# Altium schematic sheet 智能车驱动板HIP4082.SchDoc
size B; SheetNumber: 1; SheetTotal: 1
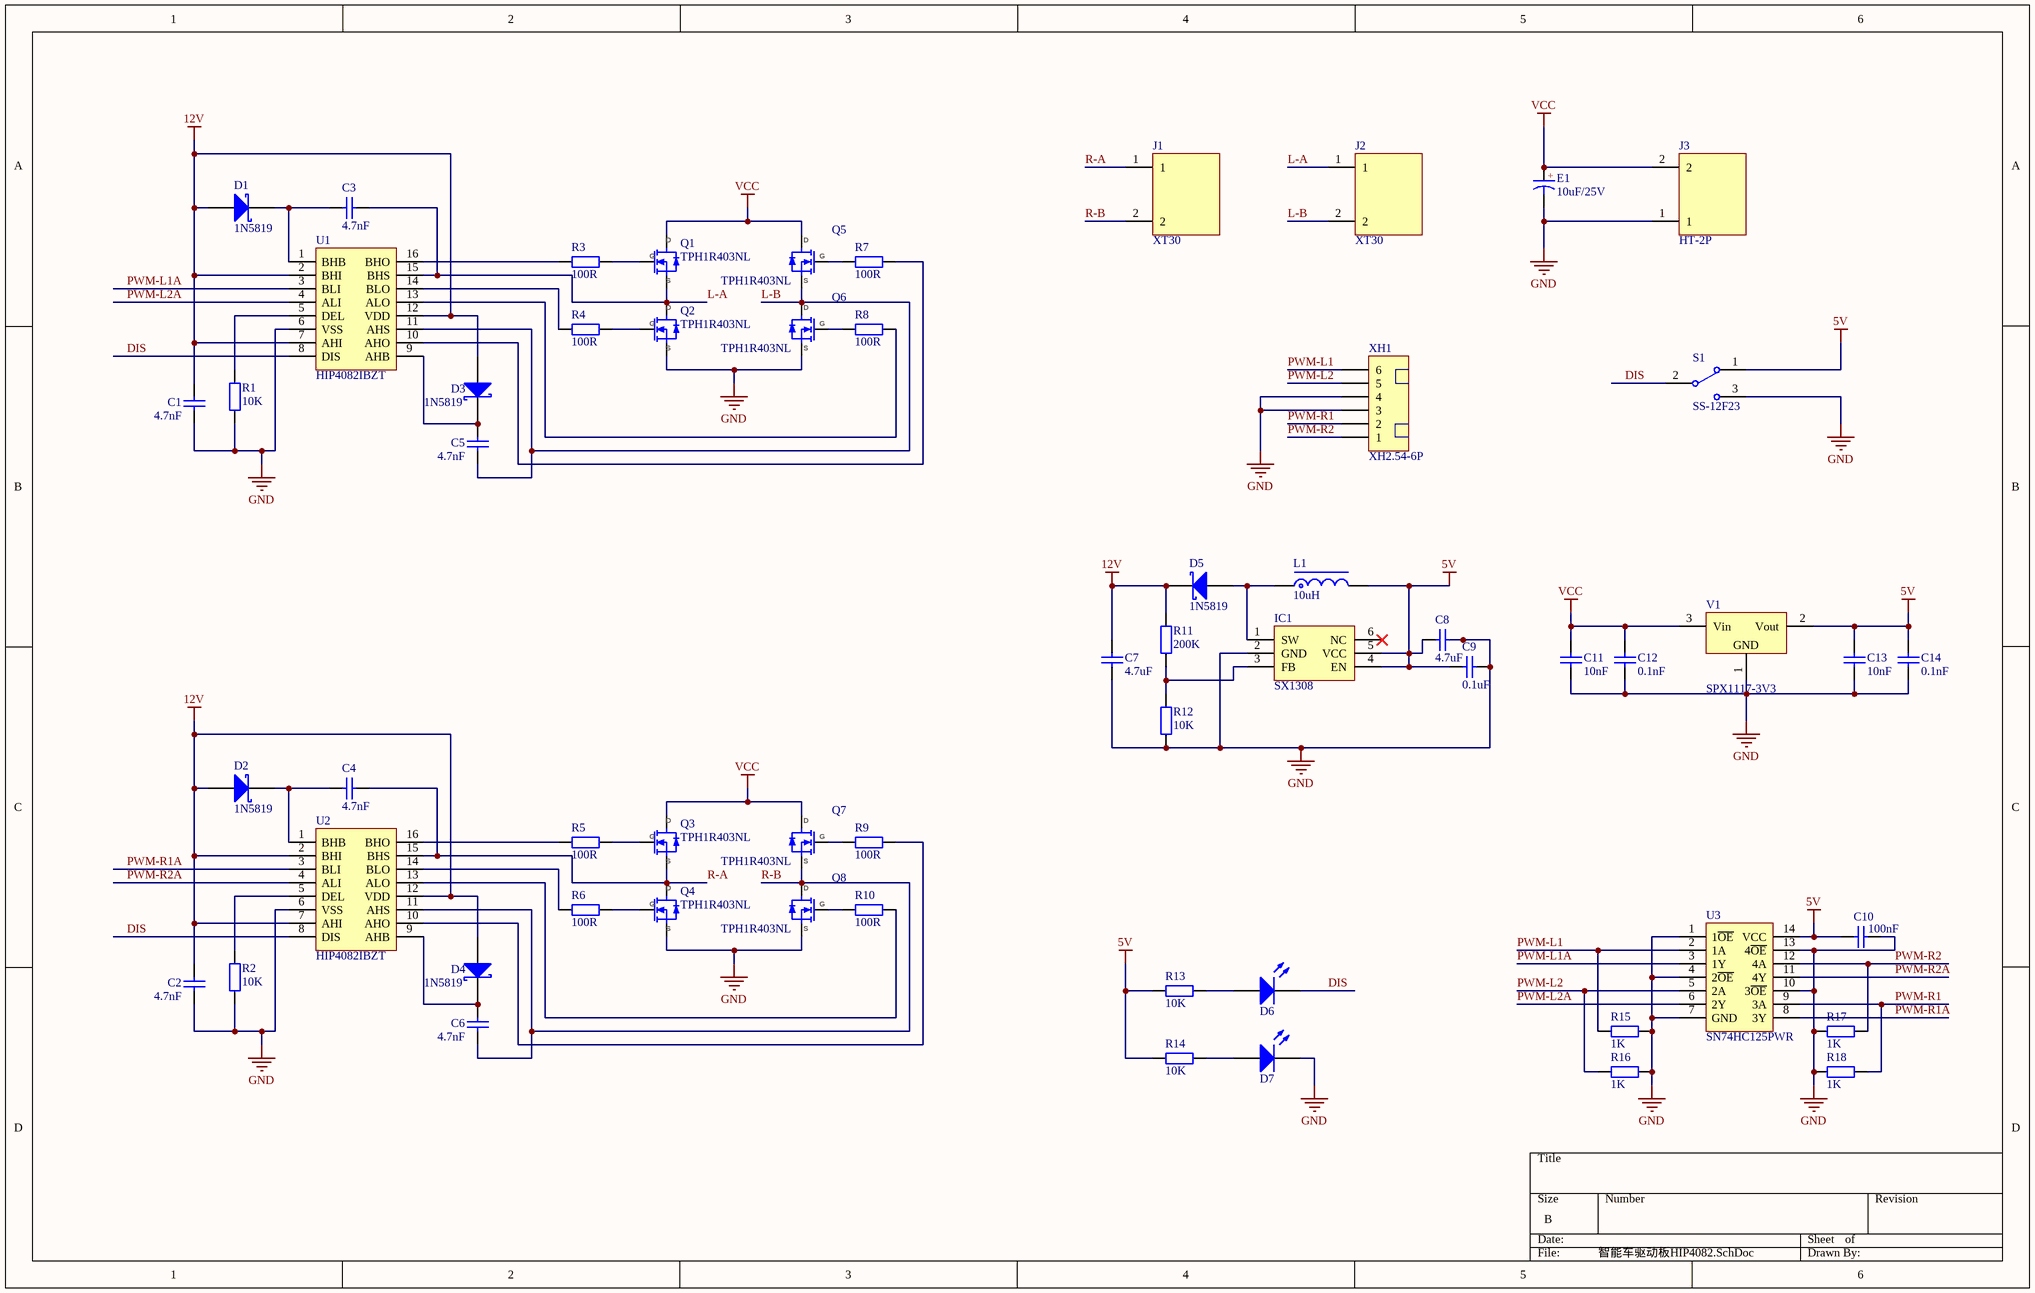
[diagram p0: 智能车驱动板HIP4082.SchDoc]

## Parts
C1  4.7nF  [C0603_L]
C2  4.7nF  [C0603_L]
C3  4.7nF  [C0603_L]
C4  4.7nF  [C0603_L]
C5  4.7nF  [C0603_L]
C6  4.7nF  [C0603_L]
C7  4.7uF  [C0603_L]
C8  4.7uF  [C0603_L]
C9  0.1uF  [C0603_L]
C10  100nF  [C0603_L]
C11  10nF  [C0603_L]
C12  0.1nF  [C0603_L]
C13  10nF  [C0603_L]
C14  0.1nF  [C0603_L]
D1  1N5819  [SOD-323]
D2  1N5819  [SOD-323]
D3  1N5819  [SOD-323]
D4  1N5819  [SOD-323]
D5  1N5819  [SOD-323]
D6  LED  [LED-0603_R]  (value not drawn)
D7  LED  [LED-0603_R]  (value not drawn)
E1  10uF/25V  [CT-2.0*5*8-R]
IC1  SX1308  [SOT23-6N]
J1  XT30  [XT30-WI]
J2  XT30  [XT30-WI]
J3  HT-2P  [CZ-5.08-L-Z-2P]
L1  10uH  [NR2520]
Q1  TPH1R403NL  [DFN5x6]
Q2  TPH1R403NL  [DFN5x6]
Q3  TPH1R403NL  [DFN5x6]
Q4  TPH1R403NL  [DFN5x6]
Q5  TPH1R403NL  [DFN5x6]
Q6  TPH1R403NL  [DFN5x6]
Q7  TPH1R403NL  [DFN5x6]
Q8  TPH1R403NL  [DFN5x6]
R1  10K  [R0603_L]
R2  10K  [R0603_L]
R3  100R  [R0603_L]
R4  100R  [R0603_L]
R5  100R  [R0603_L]
R6  100R  [R0603_L]
R7  100R  [R0603_L]
R8  100R  [R0603_L]
R9  100R  [R0603_L]
R10  100R  [R0603_L]
R11  200K  [R0603_L]
R12  10K  [R0603_L]
R13  10K  [R0603_L]
R14  10K  [R0603_L]
R15  1K  [R0603_L]
R16  1K  [R0603_L]
R17  1K  [R0603_L]
R18  1K  [R0603_L]
S1  SS-12F23  [SS-12F23]
U1  HIP4082IBZT  [SOP16_M]
U2  HIP4082IBZT  [SOP16_M]
U3  SN74HC125PWR  [TSSOP14]
V1  SPX1117-3V3  [SOT223_L]
XH1  XH2.54-6P  [XH2.54-6P-WI]

## Nets
5V: C8.1 C9.1 C10.1 C13.2 C14.2 IC1.4(EN) IC1.5(VCC) L1.2 R13.1 R14.1 S1.1 U3.14(VCC) V1.2(Vout)
12V: C1.2 C2.2 C7.2 D1.1(A) D2.1(A) D3.1(A) D4.1(A) D5.2(K) R11.2 U1.2(BHI) U1.7(AHI) U1.12(VDD) U2.2(BHI) U2.7(AHI) U2.12(VDD)
GND: C1.1 C2.1 C7.1 C8.2 C9.2 C10.2 C11.1 C12.1 C13.1 C14.1 D7.2(K) E1.2 IC1.2(GND) J3.1 Q2.3(S) Q4.3(S) Q6.3(S) Q8.3(S) R1.1 R2.1 R12.1 R15.2 R16.2 R17.1 R18.1 S1.3 U1.6(VSS) U2.6(VSS) U3.1(1~{OE}) U3.4(2~{OE}) U3.7(GND) U3.10(3~{OE}) U3.13(4~{OE}) V1.1(GND) XH1.3 XH1.4
VCC: C11.2 C12.2 E1.1 J3.2 Q1.1(D) Q3.1(D) Q5.1(D) Q7.1(D) V1.3(Vin)
DIS: D6.2(K) S1.2 U1.8(DIS) U2.8(DIS)
L-A: C3.1 J2.1 Q1.3(S) Q2.1(D) U1.15(BHS)
L-B: C5.1 J2.2 Q5.3(S) Q6.1(D) U1.11(AHS)
PWM-L1: R15.1 U3.2(1A) XH1.6
PWM-L1A: U1.3(BLI) U3.3(1Y)
PWM-L2: R16.1 U3.5(2A) XH1.5
PWM-L2A: U1.4(ALI) U3.6(2Y)
PWM-R1: R18.2 U3.9(3A) XH1.2
PWM-R1A: U2.3(BLI) U3.8(3Y)
PWM-R2: R17.2 U3.12(4A) XH1.1
PWM-R2A: U2.4(ALI) U3.11(4Y)
R-A: C4.1 J1.1 Q3.3(S) Q4.1(D) U2.15(BHS)
R-B: C6.1 J1.2 Q7.3(S) Q8.1(D) U2.11(AHS)
NetC3_2: C3.2 D1.2(K) U1.1(BHB)
NetC4_2: C4.2 D2.2(K) U2.1(BHB)
NetC5_2: C5.2 D3.2(K) U1.9(AHB)
NetC6_2: C6.2 D4.2(K) U2.9(AHB)
NetD5_1: D5.1(A) IC1.1(SW) L1.1
NetD6_1: D6.1(A) R13.2
NetD7_1: D7.1(A) R14.2
NetIC1_3: IC1.3(FB) R11.1 R12.2
NetQ1_2: Q1.2(G) R3.2
NetQ2_2: Q2.2(G) R4.2
NetQ3_2: Q3.2(G) R5.2
NetQ4_2: Q4.2(G) R6.2
NetQ5_2: Q5.2(G) R7.1
NetQ6_2: Q6.2(G) R8.1
NetQ7_2: Q7.2(G) R9.1
NetQ8_2: Q8.2(G) R10.1
NetR1_2: R1.2 U1.5(DEL)
NetR2_2: R2.2 U2.5(DEL)
NetR3_1: R3.1 U1.16(BHO)
NetR4_1: R4.1 U1.14(BLO)
NetR5_1: R5.1 U2.16(BHO)
NetR6_1: R6.1 U2.14(BLO)
NetR7_2: R7.2 U1.10(AHO)
NetR8_2: R8.2 U1.13(ALO)
NetR9_2: R9.2 U2.10(AHO)
NetR10_2: R10.2 U2.13(ALO)

Not connected (* = marked no-connect by the designer): IC1 6(NC)*

## Notes on the sheet
- (in symbol C-CS) +

## Library data of the parts
C1-C14 = C-SMD: 贴片电容; BOM名称: 无极性贴片电容
D1-D5 = 1N5819: 肖特基二极管; BOM名称: 肖特基二极管
D6 D7 = LED_SMD: 贴片发光二极管
E1 = C-CS: 直插固态电容; BOM名称: 直插固态电容
IC1 = SX1308: 可调2A升压芯片; BOM名称: 可调升压芯片
J1 J2 = XT30: 30A Low Temperature Rise Fire Retardant Plug; Manufacturer_Name: Amass; Manufacturer_Part_Number: XT30PW-M; Geometry.Height: 5mm; Mouser Part Number: *; Mouser Price/Stock: *; Arrow Part Number: *; Arrow Price/Stock: *; Datasheet Link: https://www.tme.eu/sl/Document/ce4077e36b79046da520ca73227e15de/XT30PW%20SPEC.pdf
J3 = XT30PW-M: 30A Low Temperature Rise Fire Retardant Plug; Manufacturer_Name: Amass; Geometry.Height: 5mm; Manufacturer_Part_Number: XT30PW-M; Mouser Part Number: *; Mouser Price/Stock: *; Arrow Part Number: *; Arrow Price/Stock: *; Datasheet Link: https://www.tme.eu/sl/Document/ce4077e36b79046da520ca73227e15de/XT30PW%20SPEC.pdf
L1 = L-NR: NR磁胶电感; BOM名称: NR磁胶电感
Q1-Q8 = TPH1R403NL: N沟道MOS
R1-R18 = R-SMD: 贴片电阻; BOM名称: 贴片电阻
S1 = SSW-1P: 1路波动开关; BOM名称: 波动开关
U1 U2 = HIP4082IBZT: 全桥MOSFET驱动芯片 SOP-16
U3 = SN74HC125PWR: 三态输出的四路缓冲器
V1 = SPX1117: 三端稳压芯片; BOM名称: 稳压芯片